# EAGLE design ioboard (EAGLE 8.1.1)
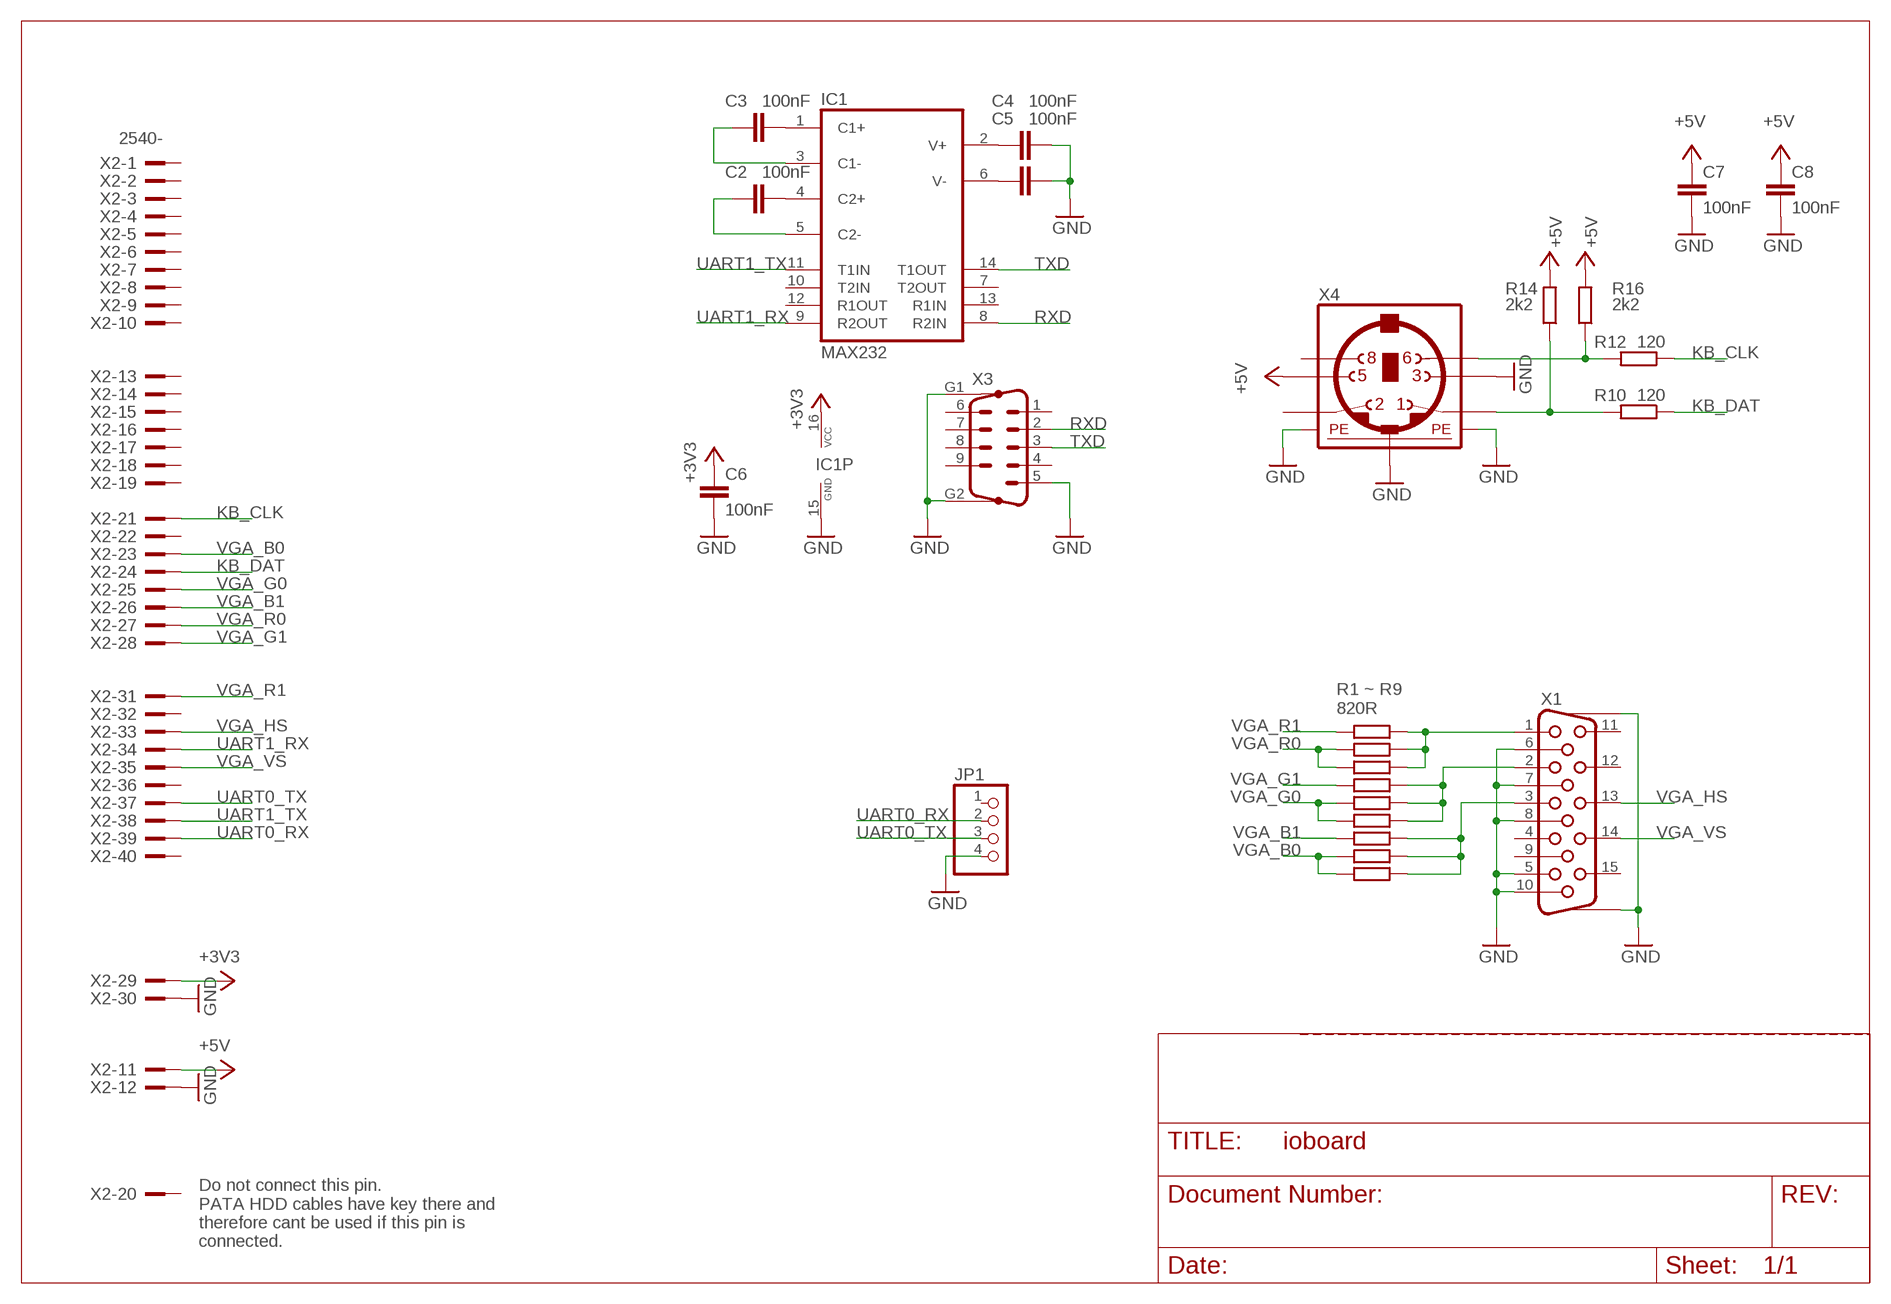
[diagram p0: schematic, sheet 1]

## Parts
C2  100nF  C-EU025-025X050  [C025-025X050]
C3  100nF  C-EU025-025X050  [C025-025X050]
C4  100nF  C-EU025-025X050  [C025-025X050]
C5  100nF  C-EU025-025X050  [C025-025X050]
C6  100nF  C-EU025-025X050  [C025-025X050]
C7  100nF  C-EU025-025X050  [C025-025X050]
C8  100nF  C-EU025-025X050  [C025-025X050]
IC1  MAX232  [DIL16]
JP1  PINHD-1X4  [1X04]
R1  820  R-EU_0204/7  [0204/7]
R2  820  R-EU_0204/7  [0204/7]
R3  820  R-EU_0204/7  [0204/7]
R4  820  R-EU_0204/7  [0204/7]
R5  820  R-EU_0204/7  [0204/7]
R6  820  R-EU_0204/7  [0204/7]
R7  820  R-EU_0204/7  [0204/7]
R8  820  R-EU_0204/7  [0204/7]
R9  820  R-EU_0204/7  [0204/7]
R10  120  R-EU_0204/7  [0204/7]
R12  120  R-EU_0204/7  [0204/7]
R14  2k2  R-EU_0204/7  [0204/7]
R16  2k2  R-EU_0204/7  [0204/7]
X1  HF15H  [HDF15H]
X2  2540-  [PAK100/2500-40]
X3  M09HP  [M09HP]
X4  MINI_DIN_6  [M_DIN6]

## Nets
+3V3: C6.1 IC1.16(VCC) X2.29
+5V: C7.1 C8.1 R14.2 R16.2 X2.11 X4.5
GND: C4.2 C5.2 C6.2 C7.2 C8.2 IC1.15(GND) JP1.4 X1.5 X1.6 X1.7 X1.8 X1.10 X1.SCH1 X1.SCH2 X2.12 X2.30 X3.5 X3.G1 X3.G2 X4.3 X4.SH1(PE1) X4.SH2(PE2) X4.SH3(PE3)
KB_CLK: R12.1 X2.21
KB_DAT: R10.1 X2.24
N$1: R12.2 R16.1 X4.6
N$2: R10.2 R14.1 X4.1
N$5: C3.2 IC1.1(C1+)
N$6: C2.2 IC1.4(C2+)
N$7: C4.1 IC1.2(V+)
N$8: R7.1 R8.1 R9.1 X1.3
N$9: R4.1 R5.1 R6.1 X1.2
N$10: R1.1 R2.1 R3.1 X1.1
N$11: C5.1 IC1.6(V-)
N$12: C3.1 IC1.3(C1-)
N$13: C2.1 IC1.5(C2-)
RXD: IC1.8(R2IN) X3.2
TXD: IC1.14(T1OUT) X3.3
UART0_RX: JP1.2 X2.39
UART0_TX: JP1.3 X2.37
UART1_RX: IC1.9(R2OUT) X2.34
UART1_TX: IC1.11(T1IN) X2.38
VGA_B0: R8.2 R9.2 X2.23
VGA_B1: R7.2 X2.26
VGA_G0: R5.2 R6.2 X2.25
VGA_G1: R4.2 X2.28
VGA_HS: X1.13 X2.33
VGA_R0: R2.2 R3.2 X2.27
VGA_R1: R1.2 X2.31
VGA_VS: X1.14 X2.35
Unconnected: IC1.7(T2OUT) IC1.10(T2IN) IC1.12(R1OUT) IC1.13(R1IN) JP1.1 X1.4 X1.9 X1.11 X1.12 X1.15 X2.1 X2.2 X2.3 X2.4 X2.5 X2.6 X2.7 X2.8 X2.9 X2.10 X2.13 X2.14 X2.15 X2.16 X2.17 X2.18 X2.19 X2.20 X2.22 X2.32 X2.36 X2.40 X3.1 X3.4 X3.6 X3.7 X3.8 X3.9 X4.2 X4.8

## Notes on the sheet
- R1 ~ R9
  820R
- Do not connect this pin.
  PATA HDD cables have key there and
  therefore cant be used if this pin is
  connected.

## Library data of the parts
C2-C8 = rcl:C-EU: CAPACITOR, European symbol
IC1 = maxim:MAX232: RS232 TRANSCEIVER; MF: MAXIM; MPN: MAX232ACPE+; OC_FARNELL: 9723773; OC_NEWARK: 68K4544
JP1 = pinhead:PINHD-1X4: PIN HEADER
R1-R10 R12 R14 R16 = rcl:R-EU_: RESISTOR, European symbol
X1 = VladisLib:HF15: SUB-D; OC_FARNELL: unknown; OC_NEWARK: unknown
X2 = con-3m:2540-: 3M (TM) Pak 100 4-Wall Header Source: 3M; OC_FARNELL: unknown; OC_NEWARK: unknown
X3 = con-subd:M09HP: SUB-D; OC_FARNELL: unknown; OC_NEWARK: unknown
X4 = mini_din:MINI_DIN_6

## Board
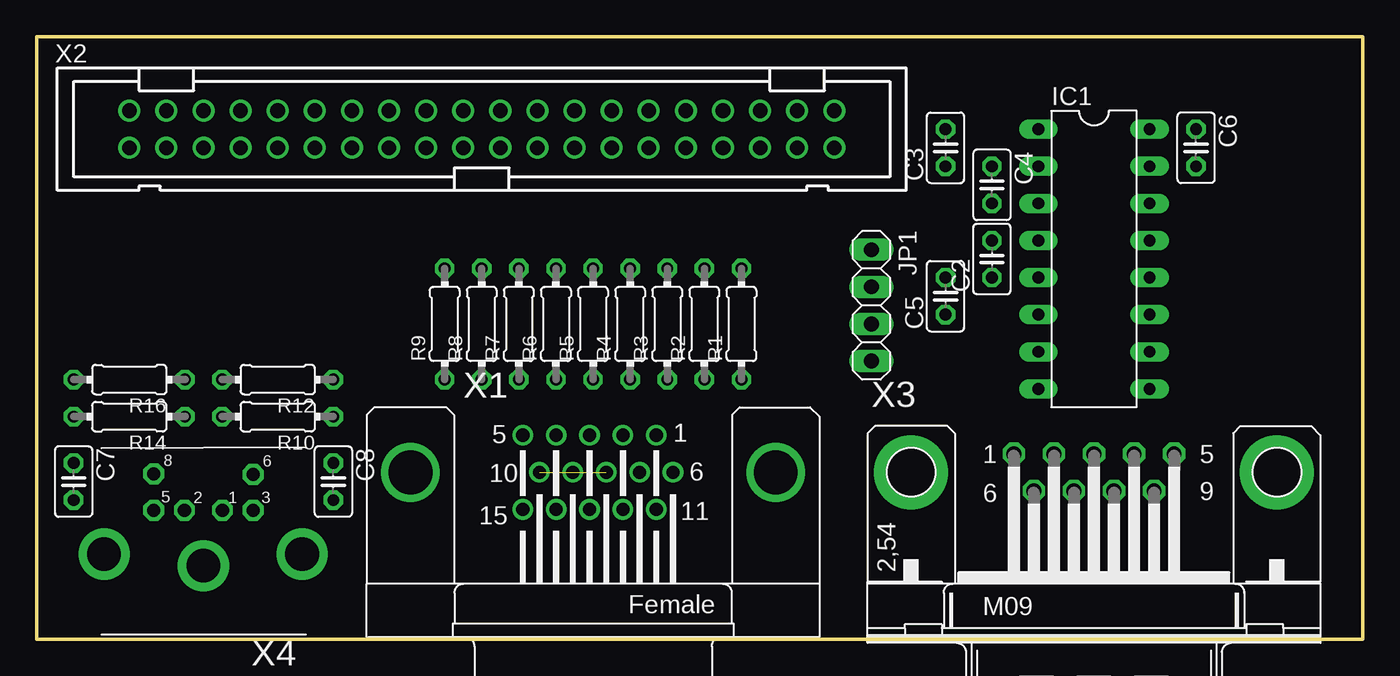
[diagram p1: board, top side]
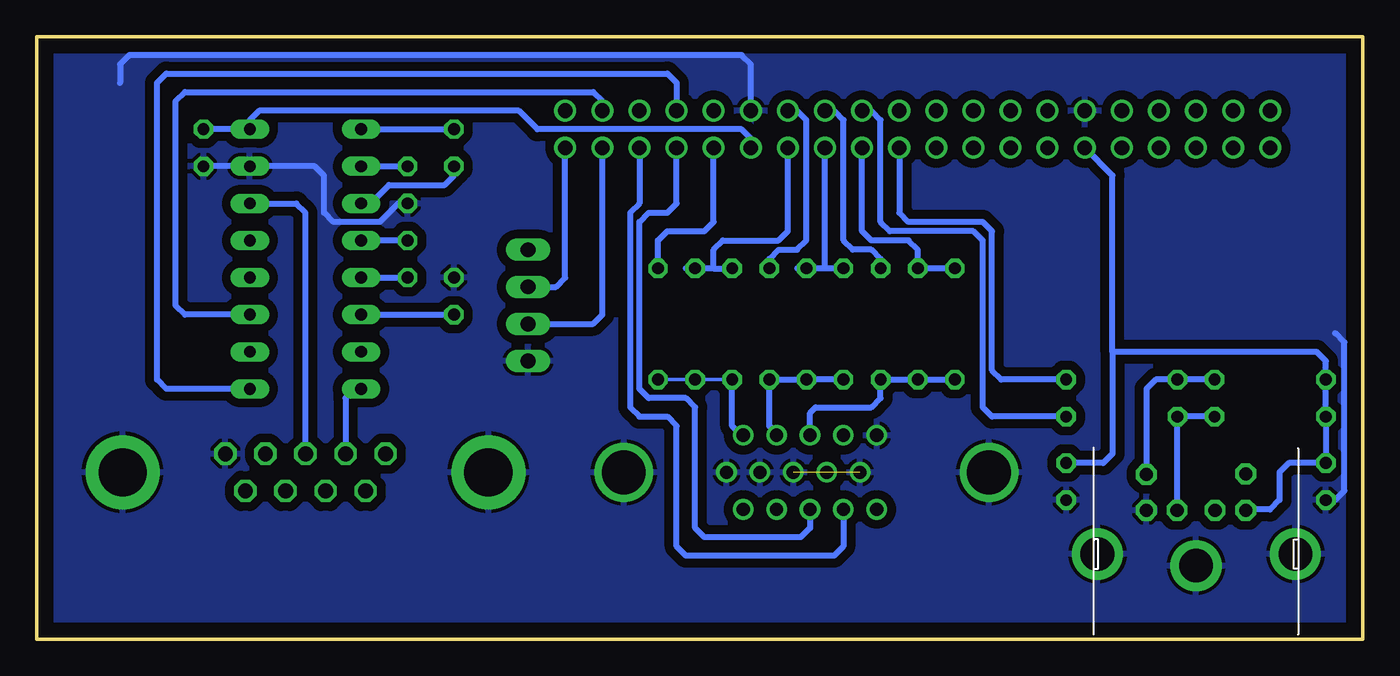
[diagram p2: board, bottom side, seen from below]

Size 90.81 x 41.27 mm. Coordinates in mm from the lower left corner, seen from the top.
Outline: 0,0 90.81,0 90.81,41.27 0,41.27 0,0
Copper layers (1*16): Top 0.035mm / dielectric 1.5mm / Bottom 0.035mm
Design rules "default": minimum track width 10mil, minimum drill 24mil, track to track 8mil, track to pad 8mil, pad to pad 8mil, via to via 8mil, smd to smd 8mil, copper to edge 40mil, drill to drill 8mil, minimum pad ring 10mil, minimum via ring 8mil, stop-mask expansion 4mil, vias tented up to drill 0mil, thermal gap 10mil

### Footprints (pad centres in the part's own frame; a part is rotated, then mirrored left to right if it is on the bottom)
C025-025X050 = drill 0.813 octagon: 1 -1.27,0; 2 1.27,0
DIL16 = drill 0.813 long: 1 -8.89,-3.81; 2 -6.35,-3.81; 3 -3.81,-3.81; 4 -1.27,-3.81; 5 1.27,-3.81; 6 3.81,-3.81; 7 6.35,-3.81; 8 8.89,-3.81; 9 8.89,3.81; 10 6.35,3.81; 11 3.81,3.81; 12 1.27,3.81; 13 -1.27,3.81; 14 -3.81,3.81; 15 -6.35,3.81; 16 -8.89,3.81
1X04 = drill 1.016 long: 1 -3.81,0; 2 -1.27,0; 3 1.27,0; 4 3.81,0
0204/7 = drill 0.813 octagon: 1 -3.81,0; 2 3.81,0
HDF15H = drill 0.9: 1 4.329,2.54; 2 2.043,2.54; 3 -0.243,2.54; 4 -2.529,2.54; 5 -4.815,2.54; 6 5.472,0; 7 3.186,0; 8 0.9,0; 9 -1.386,0; 10 -3.672,0; 11 4.329,-2.54; 12 2.043,-2.54; 13 -0.243,-2.54; 14 -2.529,-2.54; 15 -4.815,-2.54 | drill 3: SCH1 -12.5,0; SCH2 12.5,0
PAK100/2500-40 = drill 1 pad 1.422: 1 -24.13,-1.27; 2 -24.13,1.27; 3 -21.59,-1.27; 4 -21.59,1.27; 5 -19.05,-1.27; 6 -19.05,1.27; 7 -16.51,-1.27; 8 -16.51,1.27; 9 -13.97,-1.27; 10 -13.97,1.27; 11 -11.43,-1.27; 12 -11.43,1.27; 13 -8.89,-1.27; 14 -8.89,1.27; 15 -6.35,-1.27; 16 -6.35,1.27; 17 -3.81,-1.27; 18 -3.81,1.27; 19 -1.27,-1.27; 20 -1.27,1.27; 21 1.27,-1.27; 22 1.27,1.27; 23 3.81,-1.27; 24 3.81,1.27; 25 6.35,-1.27; 26 6.35,1.27; 27 8.89,-1.27; 28 8.89,1.27; 29 11.43,-1.27; 30 11.43,1.27; 31 13.97,-1.27; 32 13.97,1.27; 33 16.51,-1.27; 34 16.51,1.27; 35 19.05,-1.27; 36 19.05,1.27; 37 21.59,-1.27; 38 21.59,1.27; 39 24.13,-1.27; 40 24.13,1.27
M09HP = drill 1.016 octagon: 1 -5.486,1.27; 2 -2.743,1.27; 3 0,1.27; 4 2.743,1.27; 5 5.486,1.27; 6 -4.115,-1.27; 7 -1.372,-1.27; 8 1.372,-1.27; 9 4.115,-1.27 | drill 3.302 pad 5.08: G1 -12.522,0; G2 12.522,0
M_DIN6 = drill 0.9 pad 1.422 octagon: 1 -1.3,-3.75; 2 1.3,-3.75; 3 -3.4,-3.75; 5 3.4,-3.75; 6 -3.4,-6.2; 8 3.4,-6.25 | drill 2.3 pad 3.5: SH1 6.8,-0.75; SH2 0,0.05; SH3 -6.75,-0.75

### Placement (x,y rotation side)
C2  65.41,26.04 90 top
C3  62.23,33.66 90 top
C4  65.41,31.11 270 top
C5  62.23,23.5 90 top
C6  79.38,33.66 270 top
C7  2.54,10.79 270 top
C8  20.32,10.79 270 top
IC1  72.39,26.04 270 top
JP1  57.15,22.86 270 top
R1  48.26,21.59 90 top
R2  45.72,21.59 90 top
R3  43.18,21.59 90 top
R4  40.64,21.59 90 top
R5  38.1,21.59 90 top
R6  35.56,21.59 90 top
R7  33.02,21.59 90 top
R8  30.48,21.59 90 top
R9  27.94,21.59 90 top
R10  16.51,15.24 180 top
R12  16.51,17.78 180 top
R14  6.35,15.24 180 top
R16  6.35,17.78 180 top
X1  38.1,11.43 0 top
X2  30.48,34.92 0 top
X3  72.39,11.43 0 top
X4  11.43,5.08 180 top

### Tracks (layer width: path | path; a pad name or v marks a point on that pad's centre or on a via)
+3V3
  Bottom 0.406: C6.1 IC1.16 76.2,35.56 75.56,36.2 57.78,36.2 56.52,34.92 42.55,34.92 41.91,34.29 X2.29
+5V
  Bottom 0.406: X4.5 8.03,8.89 6.35,8.89 5.71,9.53 5.71,11.43 5.08,12.06 C7.1 R14.2 R16.2 2.54,19.05 3.17,19.68 17.14,19.68 | 17.14,19.68 17.14,12.7 17.78,12.06 C8.1 | 17.14,19.68 17.14,31.75 X2.11
GND  (1 unrouted)
  Bottom 0.406: C4.2 66.04,29.84 67.31,28.57 70.48,28.57 71.12,29.21 71.12,31.75 71.75,32.38 IC1.15 C6.2 | C7.2 1.91,9.53 1.27,10.16 1.27,20.32 1.91,20.95 | X2.30 41.91,39.37 42.55,40.01 84.45,40.01 85.09,39.37 85.09,38.1
  pour Bottom (isolate 0.61): 0,0 90.81,0 90.81,41.27 0,41.27
KB_CLK
  Bottom 0.406: R12.1 24.77,17.78 25.4,18.41 25.4,27.94 26.04,28.57 31.11,28.57 31.75,29.21 X2.21
KB_DAT
  Bottom 0.406: R10.1 25.4,15.24 26.04,15.88 26.04,27.3 26.67,27.94 32.38,27.94 33.02,28.57 33.02,35.56 33.66,36.2 X2.24
N$1
  Bottom 0.406: R16.1 R12.2 14.2,17.78 14.83,17.14 X4.6
N$2
  Bottom 0.406: R14.1 R10.2 12.73,15.24 X4.1
N$5
  Bottom 0.406: IC1.1 C3.2
N$6
  Bottom 0.406: C2.2 IC1.4
N$7
  Bottom 0.406: IC1.2 C4.1
N$8
  Bottom 0.406: R9.1 R8.1 R7.1 33.02,16.51 33.66,15.88 37.47,15.88 37.86,15.48 X1.3
N$9
  Bottom 0.406: R6.1 R5.1 R4.1 40.64,14.61 40.14,14.11 X1.2
N$10
  Bottom 0.254: R3.1 R2.1 R1.1
  Bottom 0.406: X1.1 42.55,13.97 43.18,14.61 R3.1
N$11
  Bottom 0.406: IC1.6 C5.1
N$12
  Bottom 0.406: IC1.3 67.94,29.84 66.67,31.11 62.87,31.11 62.23,31.75 C3.1
N$13
  Bottom 0.406: IC1.5 C2.1
RXD
  Bottom 0.406: IC1.8 69.01,17.14 69.65,16.51 X3.2
TXD
  Bottom 0.406: IC1.14 73.03,29.84 72.39,29.21 X3.3
UART0_RX
  Bottom 0.406: X2.39 54.61,24.77 55.24,24.13 JP1.2
UART0_TX
  Bottom 0.406: JP1.3 52.7,21.59 52.07,22.23 X2.37
UART1_RX
  Bottom 0.406: IC1.9 81.92,17.14 82.55,17.78 82.55,38.1 81.92,38.73 47.62,38.73 46.99,38.1 X2.34
UART1_TX
  Bottom 0.406: IC1.11 80.64,22.23 81.28,22.86 81.28,36.83 80.64,37.47 52.7,37.47 52.07,36.83 X2.38
VGA_B0
  Bottom 0.406: R9.2 R8.2 30.48,26.67 31.11,27.3 33.66,27.3 34.29,27.94 X2.23
VGA_B1
  Bottom 0.406: R7.2 33.02,26.04 33.66,26.67 34.92,26.67 35.56,27.3 35.56,35.56 36.2,36.2 X2.26
VGA_G0
  Bottom 0.406: R6.2 36.83,25.4 | 36.83,25.4 R5.2 38.73,25.4 | 36.83,25.4 X2.25
VGA_G1
  Bottom 0.406: R4.2 40.64,26.04 40.01,26.67 38.73,26.67 38.1,27.3 38.1,35.56 38.73,36.2 X2.28
VGA_HS
  Bottom 0.406: X1.13 37.86,7.62 38.49,6.99 45.09,6.99 45.72,7.62 45.72,15.88 46.35,16.51 48.9,16.51 49.53,17.14 49.53,28.57 48.9,29.21 47.62,29.21 46.99,29.84 X2.33
VGA_R0
  Bottom 0.406: 44.45,25.4 R3.2 | 44.45,25.4 R2.2 46.35,25.4 | 44.45,25.4 44.45,26.67 43.81,27.3 40.01,27.3 39.37,27.94 X2.27
VGA_R1
  Bottom 0.406: R1.2 48.26,27.3 47.62,27.94 45.09,27.94 44.45,28.57 X2.31
VGA_VS
  Bottom 0.406: X1.14 35.57,6.35 36.21,5.71 46.35,5.71 46.99,6.35 46.99,14.61 47.62,15.24 49.53,15.24 50.16,15.88 50.16,29.21 49.53,29.84 X2.35